# EAGLE design eeZeePower (EAGLE 6.4)
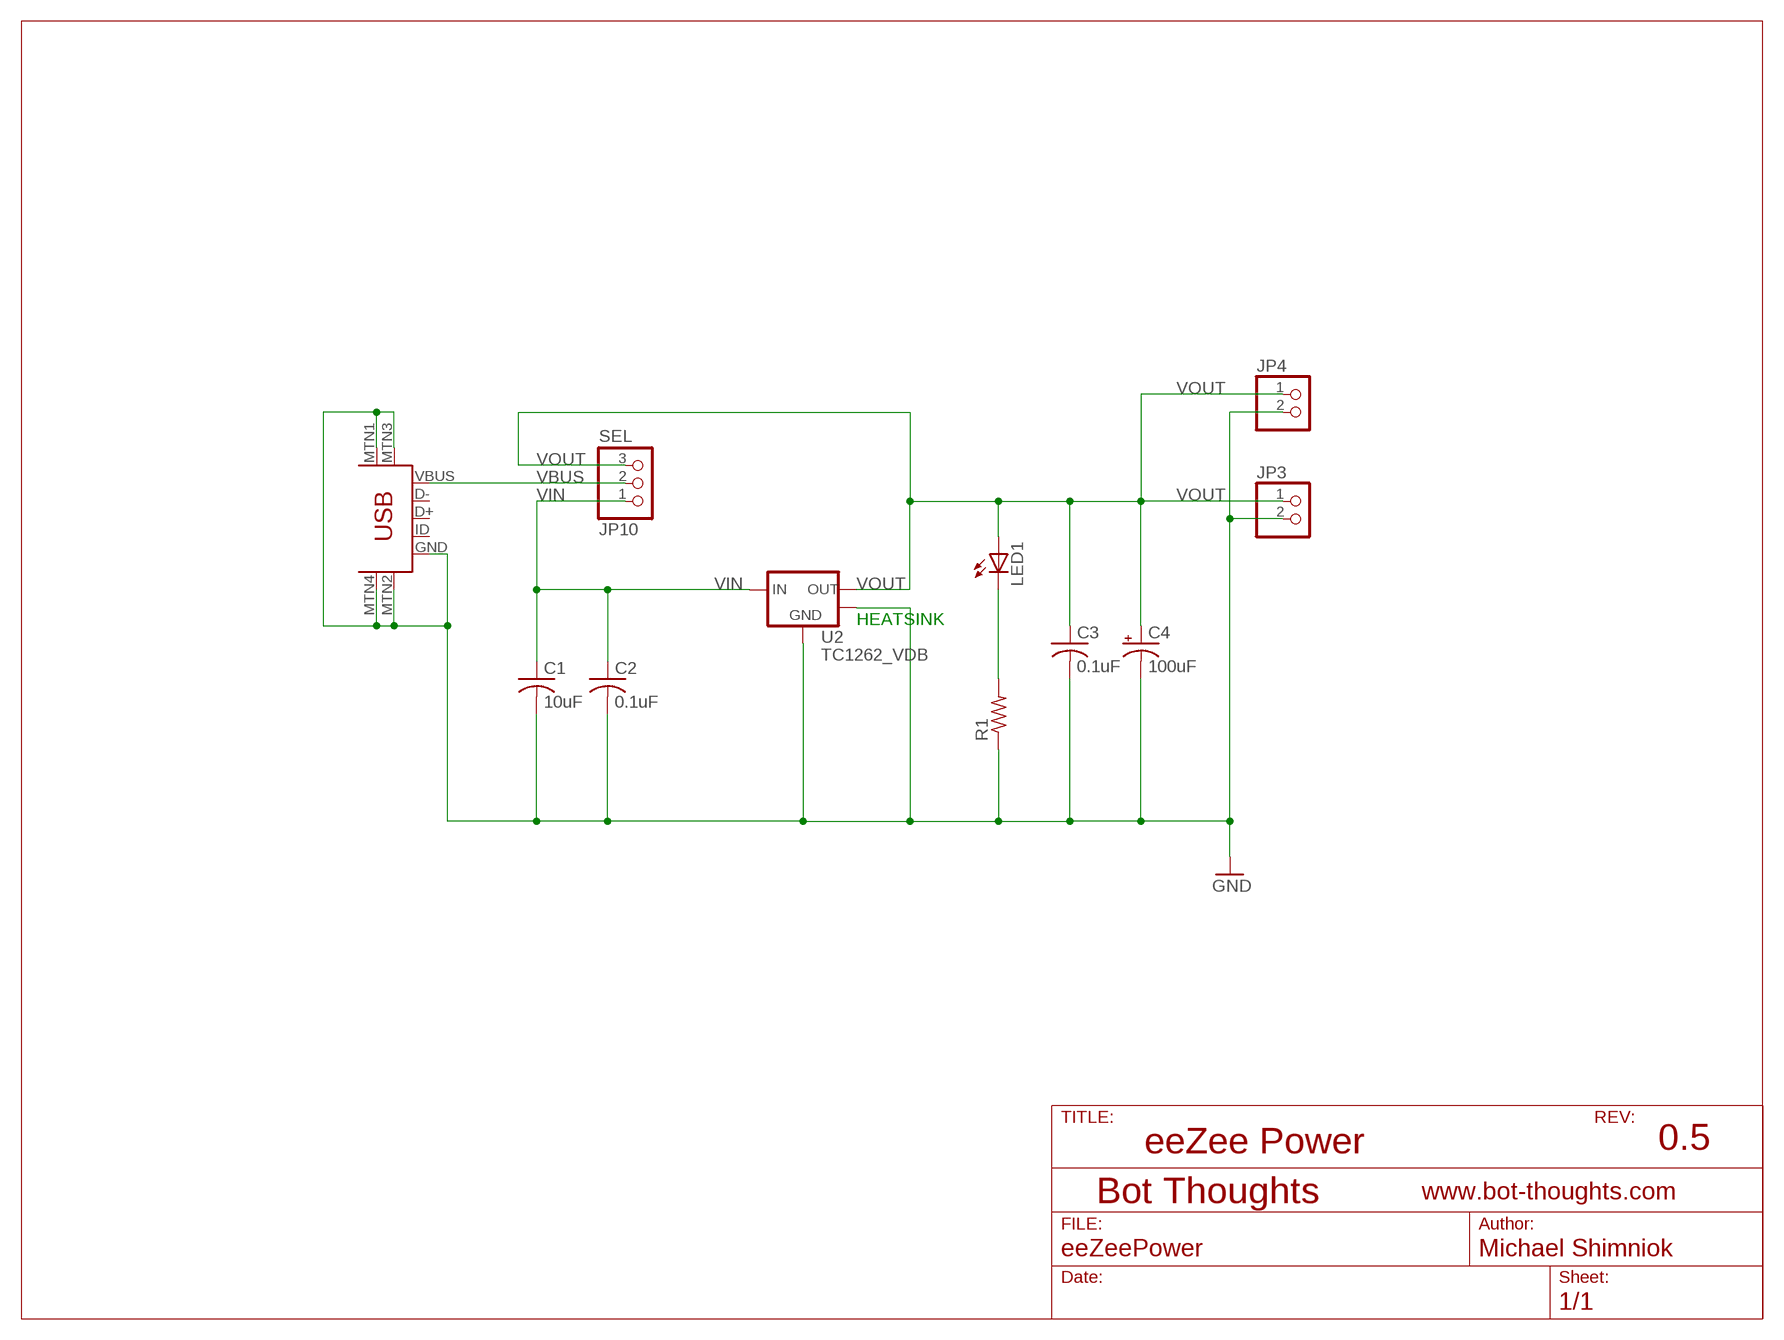
[diagram p0: schematic, sheet 1]

## Parts
C1  10uF  C-USC1206  [C1206]
C2  0.1uF  C-USC0603  [C0603]
C3  0.1uF  C-USC0603  [C0603]
C4  100uF  CPOL-USSMCB  [SMC_B]
JP3  PINHD-1X02_2.54-S  [1X02-S]
JP4  PINHD-1X02_2.54-S  [1X02-S]
JP10  SEL  PINHD-1X03_2.54-S  [1X03-S]
LED1  LEDCHIPLED_1206  [CHIPLED_1206]
R1  R-US_R0603  [R0603]
U2  TC1262_VDB  [SOT-223-3]
U$1  USB-MINIB-5PIN  [USB-MINIB]

## Nets
GND: C1.2 C2.2 C3.2 C4.- JP3.2 JP4.2 R1.1 U2.2(GND) U2.4(TAB) U$1.GND U$1.MTN1(MTN2) U$1.MTN2(MTN3) U$1.MTN3(MTN1) U$1.MTN4
N$5: LED1.C R1.2
VBUS: JP10.2 U$1.VBUS
VIN: C1.1 C2.1 JP10.1 U2.1(VIN)
VOUT: C3.1 C4.+ JP3.1 JP4.1 JP10.3 LED1.A U2.3(VOUT)
Unconnected: U$1.D+ U$1.D- U$1.ID

## Notes on the sheet
- HEATSINK
- eeZee Power | 0.5

## Library data of the parts
C1-C3 = rcl:C-US: CAPACITOR, American symbol
C4 = rcl:CPOL-US: POLARIZED CAPACITOR, American symbol
JP3 JP4 = pinhead-2:PINHD-1X02: PIN HEADER
JP10 = pinhead-2:PINHD-1X03: PIN HEADER
LED1 = led:LED: LED OSRAM: - CHIPLED LG R971, LG N971, LY N971, LG Q971, LY Q971, LO R971, LY R971 LH N974, LH R974 LS Q976, LO Q976, LY Q976 LO Q996 - Hyper CHIPLED LW Q18S LB Q993, LB Q99A, LB R99A - SideLED LS A670, LO A670, LY A670, LG A670, LP A670 LB A673, LV A673, LT A673, LW A673 LH A674 LY A675 LS A676, LA A676, LO A676, LY A676, LW A676 LS A679, LY A679, LG A679 - Hyper Micro SIDELED® LS Y876, LA Y876, LO Y876, LY Y876 LT Y87S - SmartLED LW L88C, LW L88S LB L89C, LB L89S, LG L890 LS L89K, LO L89K, LY L89K LS L896, LA L896, LO L896, LY L896 - TOPLED LS T670, LO T670, LY T670, LG T670, LP T670 LSG T670, LSP T670, LSY T670, LOP T670, LYG T670 LG T671, LOG T671, LSG T671 LB T673, LV T673, LT T673, LW T673 LH T674 LS T676, LA T676, LO T676, LY T676, LB T676, LH T676, LSB T676, LW T676 LB T67C, LV T67C, LT T67C, LS T67K, LO T67K, LY T67K, LW E67C LS E67B, LA E67B, LO E67B, LY E67B, LB E67C, LV E67C, LT E67C LW T67C LS T679, LY T679, LG T679 LS T770, LO T770, LY T770, LG T770, LP T770 LB T773, LV T773, LT T773, LW T773 LH T774 LS E675, LA E675, LY E675, LS T675 LS T776, LA T776, LO T776, LY T776, LB T776 LHGB T686 LT T68C, LB T68C - Hyper Mini TOPLED® LB M676 - Mini TOPLED Santana® LG M470 LS M47K, LO M47K, LY M47K Source: http://www.osram.convergy.de LUXEON: - LUMILED® LXK2-PW12-R00, LXK2-PW12-S00, LXK2-PW14-U00, LXK2-PW14-V00 LXK2-PM12-R00, LXK2-PM12-S00, LXK2-PM14-U00 LXK2-PE12-Q00, LXK2-PE12-R00, LXK2-PE12-S00, LXK2-PE14-T00, LXK2-PE14-U00 LXK2-PB12-K00, LXK2-PB12-L00, LXK2-PB12-M00, LXK2-PB14-N00, LXK2-PB14-P00, LXK2-PB14-Q00 LXK2-PR12-L00, LXK2-PR12-M00, LXK2-PR14-Q00, LXK2-PR14-R00 LXK2-PD12-Q00, LXK2-PD12-R00, LXK2-PD12-S00 LXK2-PH12-R00, LXK2-PH12-S00 LXK2-PL12-P00, LXK2-PL12-Q00, LXK2-PL12-R00 Source: www.luxeon.com KINGBRIGHT: KA-3528ASYC Source: www.kingbright.com
R1 = resistor:R-US_: RESISTOR, American symbol
U2 = bt_regulator:TC1262: Microchip TC1262 LDO Regulator The TC1262 is a fixed output, high accuracy (typically ±0.5%) CMOS low dropout regulator. Designed specif- ically for battery-operated systems, the TC1262’s CMOS construction eliminates wasted ground current, significantly extending battery life. Total supply current is typically 80A at full load (20 to 60 times lower than in bipolar regulators). TC1262 key features include ultra low noise operation, very low dropout voltage (typically 350mV at full load), and fast response to step changes in load. Datasheet.pdf <http://ww1.microchip.com/downloads/en/DeviceDoc/21373C.pdf>
U$1 = SparkFun:USB-MINIB: Mini-USB "B" connector with 5th pin broken out. Created new symbol breaking out 5th "ID" pin in mini/micro USB connector spec. See: http://en.wikipedia.org/wiki/Mini_usb#Cables. Uses same footprint as 4-pin symbol. Also added pins to connect to mounting / shield pads if required (probably not generally needed as signals aren't shielded once they leave the connector).

## Board
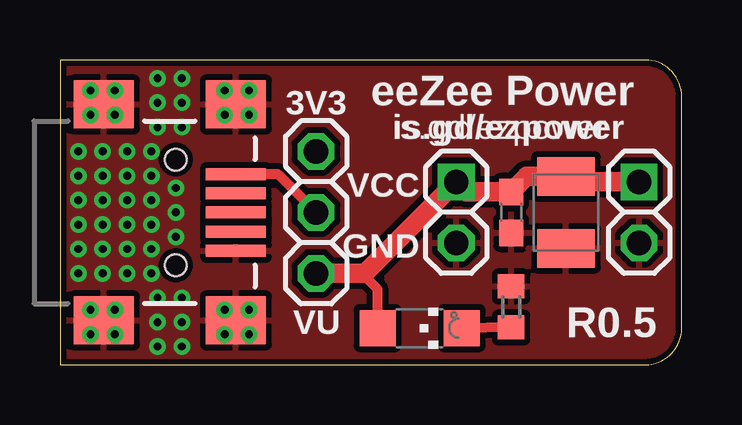
[diagram p1: board, top side]
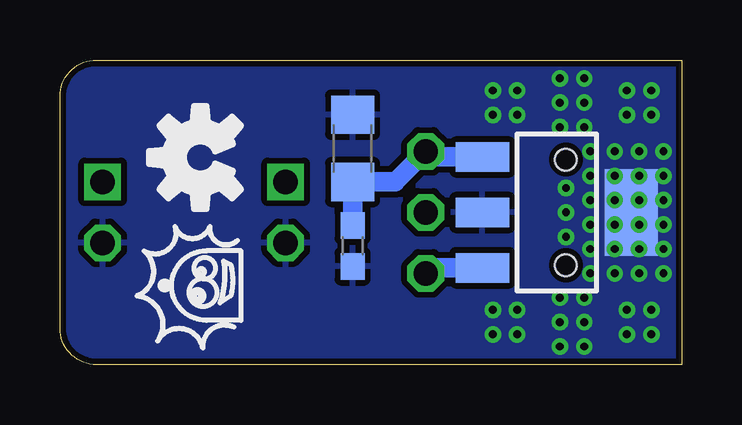
[diagram p2: board, bottom side, seen from below]

Size 25.91 x 12.7 mm. Coordinates in mm from the lower left corner, seen from the top.
Outline: 0,0 24.38,0 arc90 25.91,1.52 25.91,11.18 arc90 24.38,12.7 0,12.7 0,0
Copper layers (1*16): Top 0.0356mm / dielectric 1.5011mm / Bottom 0.0356mm
Design rules "LaenPCBOrder *": minimum track width 6mil, minimum drill 13mil, track to track 10mil, track to pad 10mil, pad to pad 10mil, via to via 10mil, smd to smd 8mil, copper to edge 10mil, drill to drill 10mil, minimum pad ring 7mil, minimum via ring 7mil, stop-mask expansion 3mil, vias tented up to drill 20mil, thermal gap 10mil

### Footprints (pad centres in the part's own frame; a part is rotated, then mirrored left to right if it is on the bottom)
C1206 = smd 1.6 x 1.8: 1 -1.4,0; 2 1.4,0
C0603 = smd 1.1 x 1: 1 -0.85,0; 2 0.85,0
SMC_B = smd 1.6 x 2.4: + -1.5,0; - 1.5,0
1X02-S = drill 1.016 square: 1 -1.27,0 | drill 1.016 octagon: 2 1.27,0
1X03-S = drill 1.016 octagon: 1 -2.54,0; 2 0,0; 3 2.54,0
CHIPLED_1206 = smd 1.5 x 1.5: A 0,-1.75; C 0,1.75
R0603 = smd 1 x 1.1: 1 -0.85,0; 2 0.85,0
SOT-223-3 = smd 1.219 x 2.235: 1 -2.311,-3.099; 2 0,-3.099; 3 2.311,-3.099 | smd 3.6 x 2.2: 4 0,3.099
USB-MINIB = smd 2.5 x 0.5: D+ 2.5,0; D- 2.5,0.8; GND 2.5,-1.6; ID 2.5,-0.8; VBUS 2.5,1.6 | smd 2.5 x 2: MTN1 -3,4.5; MTN2 2.5,4.5; MTN3 -3,-4.5; MTN4 2.5,-4.5 | hole 0.9: 0,2.2; 0,-2.2

### Placement (x,y rotation side)
C1  13.72,9.02 90 bottom
C2  13.72,4.95 270 bottom
C3  18.8,6.35 270 top
C4  21.08,6.35 270 top
JP3  16.51,6.35 270 top
JP4  24.13,6.35 270 top
JP10  10.67,6.35 270 top
LED1  14.99,1.52 270 top
R1  18.8,2.41 270 top
U2  5.21,6.35 270 bottom
U$1  4.83,6.35 0 top

### Tracks (layer width: path | path; a pad name or v marks a point on that pad's centre or on a via)
GND  (via drill 0.33)
  other vias: 0.76,6.86 1.78,6.86 0.76,7.87 0.76,8.89 0.76,5.84 0.76,4.83 0.76,3.81 1.78,8.89 2.79,8.89 3.81,8.89 3.81,7.87 3.81,6.86 3.81,5.84 3.81,4.83 3.81,3.81 1.78,7.87 2.79,7.87 2.79,6.86 4.83,7.37 4.83,5.33 4.83,6.35 2.79,5.84 2.79,4.83 2.79,3.81 1.78,3.81 1.78,4.83 1.78,5.84 4.06,9.91 5.08,9.91 5.08,10.92 4.06,10.92 5.08,11.94 4.06,11.94 4.06,2.79 4.06,1.78 4.06,0.76 5.08,0.76 5.08,1.78 5.08,2.79 1.27,11.43 2.29,11.43 1.27,10.41 2.29,10.41 6.86,11.43 7.87,11.43 7.87,10.41 6.86,10.41 6.86,2.29 7.87,2.29 7.87,1.27 6.86,1.27 2.29,1.27 1.27,1.27 1.27,2.29 2.29,2.29
  pour Top (rank 3): 0,12.7 24.38,12.7 arc-90 25.91,11.18 25.91,1.52 arc-90 24.38,0 0,0
  pour Bottom (rank 2): 0,12.7 24.38,12.7 arc-90 25.91,11.18 25.91,1.52 arc-90 24.38,0 0,0
  pour Bottom (no thermals): 0.38,8.64 3.68,8.64 3.68,3.94 0.38,3.94
N$5
  Top 0.406: R1.2 LED1.C
VBUS
  Top 0.406: U$1.VBUS 9.07,7.95 JP10.2
VIN
  Bottom 0.813: U2.1 10.44,8.66 JP10.1 11.94,7.62 C1.1 C2.1
VOUT
  Top 0.406: LED1.A 13.24,3.15 12.57,3.81
  Top 0.813: JP4.1 21.31,7.62 C4.+ 19.45,7.85 C3.1 16.93,7.2 JP3.1 12.7,3.81 12.57,3.81 JP10.3
  Bottom 0.813: U2.3 10.44,4.04 JP10.3

### Text on the board
tPlace: is.gd/ezpower | R0.5
tValues: eeZee Power | 3V3 | VCC | GND | VU
tsilk: eeZee Power | 3V3 | is.gd/ezpower | VCC | GND | VU | R0.5